# EAGLE design rectifier (EAGLE 5.05)
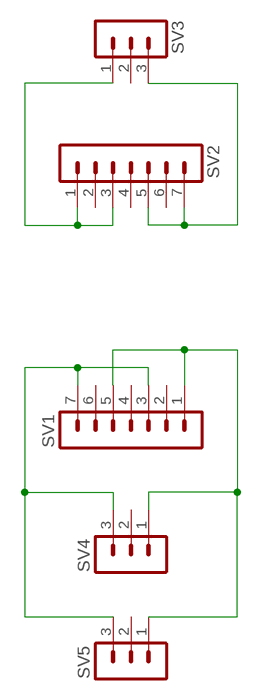
[diagram p0: schematic, sheet 1]

## Parts
SV1  MA07-1  [MA07-1]
SV2  MA07-1  [MA07-1]
SV3  MA03-1  [MA03-1]
SV4  MA03-1  [MA03-1]
SV5  MA03-1  [MA03-1]

## Nets
N$1: SV2.1 SV2.3 SV3.1
N$2: SV2.5 SV2.7 SV3.3
N$3: SV1.3 SV1.7 SV4.3 SV5.3
N$4: SV1.1 SV1.5 SV4.1 SV5.1
Unconnected: SV1.2 SV1.4 SV1.6 SV2.2 SV2.4 SV2.6 SV3.2 SV4.2 SV5.2

## Library data of the parts
SV1 SV2 = con-lstb:MA07-1: PIN HEADER
SV3-SV5 = con-lstb:MA03-1: PIN HEADER

## Board
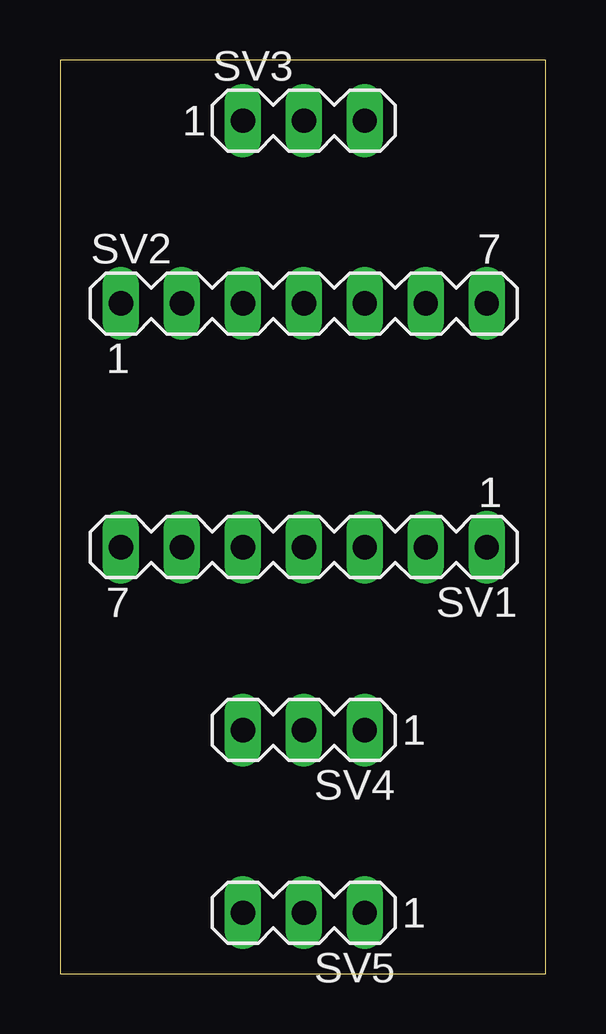
[diagram p1: board, top side]
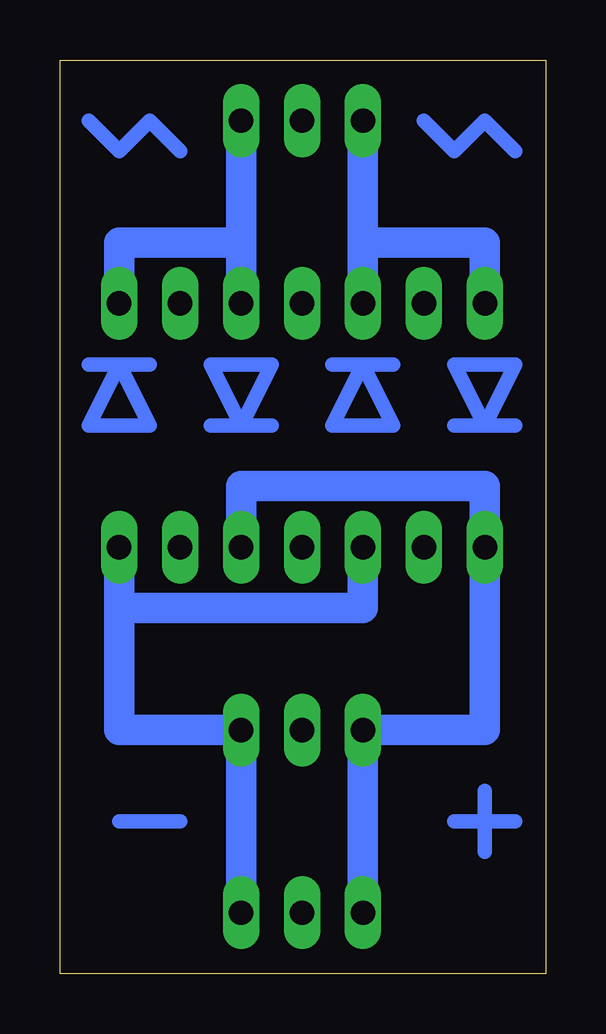
[diagram p2: board, bottom side, seen from below]

Size 20.24 x 38.09 mm. Coordinates in mm from the lower left corner, seen from the top.
Outline: 0,0 20.24,0 20.24,38.09 0,38.09 0,0
Copper layers (1*16): Top 0.035mm / dielectric 1.5mm / Bottom 0.035mm
Design rules "default": minimum track width 10mil, minimum drill 24mil, track to track 8mil, track to pad 8mil, pad to pad 8mil, via to via 8mil, smd to smd 8mil, copper to edge 40mil, drill to drill 8mil, minimum pad ring 10mil, minimum via ring 8mil, stop-mask expansion 4mil, vias tented up to drill 0mil, thermal gap 10mil

### Footprints (pad centres in the part's own frame; a part is rotated, then mirrored left to right if it is on the bottom)
MA07-1 = drill 1.016 long: 1 -7.62,0; 2 -5.08,0; 3 -2.54,0; 4 0,0; 5 2.54,0; 6 5.08,0; 7 7.62,0
MA03-1 = drill 1.016 long: 1 -2.54,0; 2 0,0; 3 2.54,0

### Placement (x,y rotation side)
SV1  10.16,17.78 180 top
SV2  10.16,27.94 0 top
SV3  10.16,35.56 0 top
SV4  10.16,10.16 180 top
SV5  10.16,2.54 180 top

### Tracks (layer width: path | path; a pad name or v marks a point on that pad's centre or on a via)
N$1
  Bottom 1.27: 7.62,30.48 SV3.1 | 7.62,30.48 SV2.3 | 7.62,30.48 2.54,30.48 SV2.1
N$2
  Bottom 1.27: 12.7,30.48 12.7,33.02 SV3.3 | SV2.5 12.7,30.48 | 12.7,30.48 17.78,30.48 SV2.7
N$3
  Bottom 1.27: SV1.3 12.7,20.32 2.54,20.32 SV1.7 2.54,10.16 SV4.3 SV5.3
N$4
  Bottom 1.27: SV1.5 7.62,15.24 17.78,15.24 | 17.78,15.24 SV1.1 | 17.78,15.24 17.78,10.16 SV4.1 SV5.1
N$5
  Bottom 0.61: 1.27,25.4 3.81,25.4 2.54,22.86 1.27,25.4
N$6
  Bottom 0.61: 1.27,22.86 3.81,22.86
N$7
  Bottom 0.61: 6.35,25.4 7.62,25.4 | 7.62,25.4 8.89,25.4 | 7.62,25.4 8.89,22.86 6.35,22.86 7.62,25.4
N$8
  Bottom 0.61: 11.43,22.86 12.7,22.86 | 12.7,22.86 11.43,25.4 13.97,25.4 12.7,22.86 | 12.7,22.86 13.97,22.86
N$9
  Bottom 0.61: 16.51,25.4 17.78,25.4 | 17.78,25.4 16.51,22.86 19.05,22.86 17.78,25.4 | 17.78,25.4 19.05,25.4
N$10
  Bottom 0.61: 2.54,7.62 2.54,5.08
N$11
  Bottom 0.61: 1.27,6.35 3.81,6.35
N$12
  Bottom 0.61: 15.24,6.35 17.78,6.35
N$13
  Bottom 0.61: 1.27,34.29 2.54,35.56 3.81,34.29 5.08,35.56
N$14
  Bottom 0.61: 15.24,34.29 16.51,35.56 17.78,34.29 19.05,35.56